# Altium schematic sheet Purple_Pill.SchDoc: =DocumentName
size 393 x 281 mm; Date: Do not fill; ApprovedBy: Do not fill; CheckedBy: Do not fill; CompanyName: STAR; DrawnBy: Do not fill; Engineer: Do not fill; Organization: STAR; Address1: Avenida Peseta 68, 1ºB; Address2: Madrid, Madrid 28054; Address3: +34603739927; Address4: contact.star@uc3m.es; DocumentNumber: Do not fill; SheetNumber: 1; SheetTotal: 4; Project Name: Purple Pill; Sheet Name: Purple Pill; Time: Do not fill; ImagePath: Do not fill; Application_BuildNumber: Do not fill
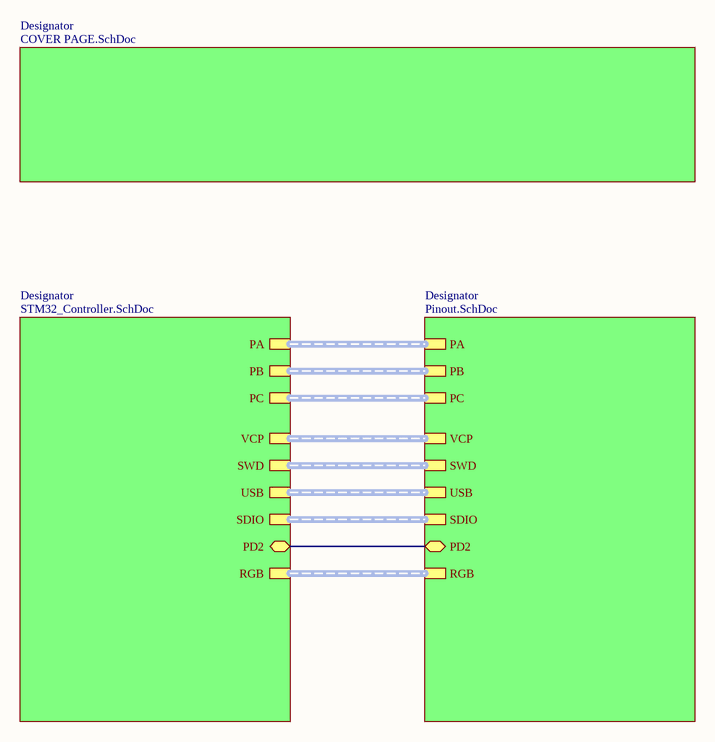
[diagram p0: Purple_Pill.SchDoc]

## Sub-sheets
Designator = STM32_Controller.SchDoc: PA (harness GPIO1), PB (harness GPIO2), PC (harness GPIO3), VCP (harness VCP), SWD (harness SWD), USB (harness USB), SDIO (harness SDIO), PD2 (bidir), RGB (harness RGB)
Designator = Pinout.SchDoc: PA (harness GPIO1), PB (harness GPIO2), PC (harness GPIO3), VCP (harness VCP), SWD (harness SWD), USB (harness USB), SDIO (harness SDIO), PD2 (bidir), RGB (harness RGB)
Designator = COVER PAGE.SchDoc: no entries

## Nets
(unnamed): sheet Designator/PD2, sheet Designator/PD2

## Notes on the sheet
- SHEET NAME
- FILE NAME
- A3
- SIZE
- PROJECT NAME
- AUTHOR
- SHEET
- OF
- REV